# EasyEDA schematic SCH_everglow.json
TITLE: Sheet_1; REV: 1.0; Date: 2023-06-11; Sheet: 1/1; Drawn By: Sammy Oina; Company: Your Company
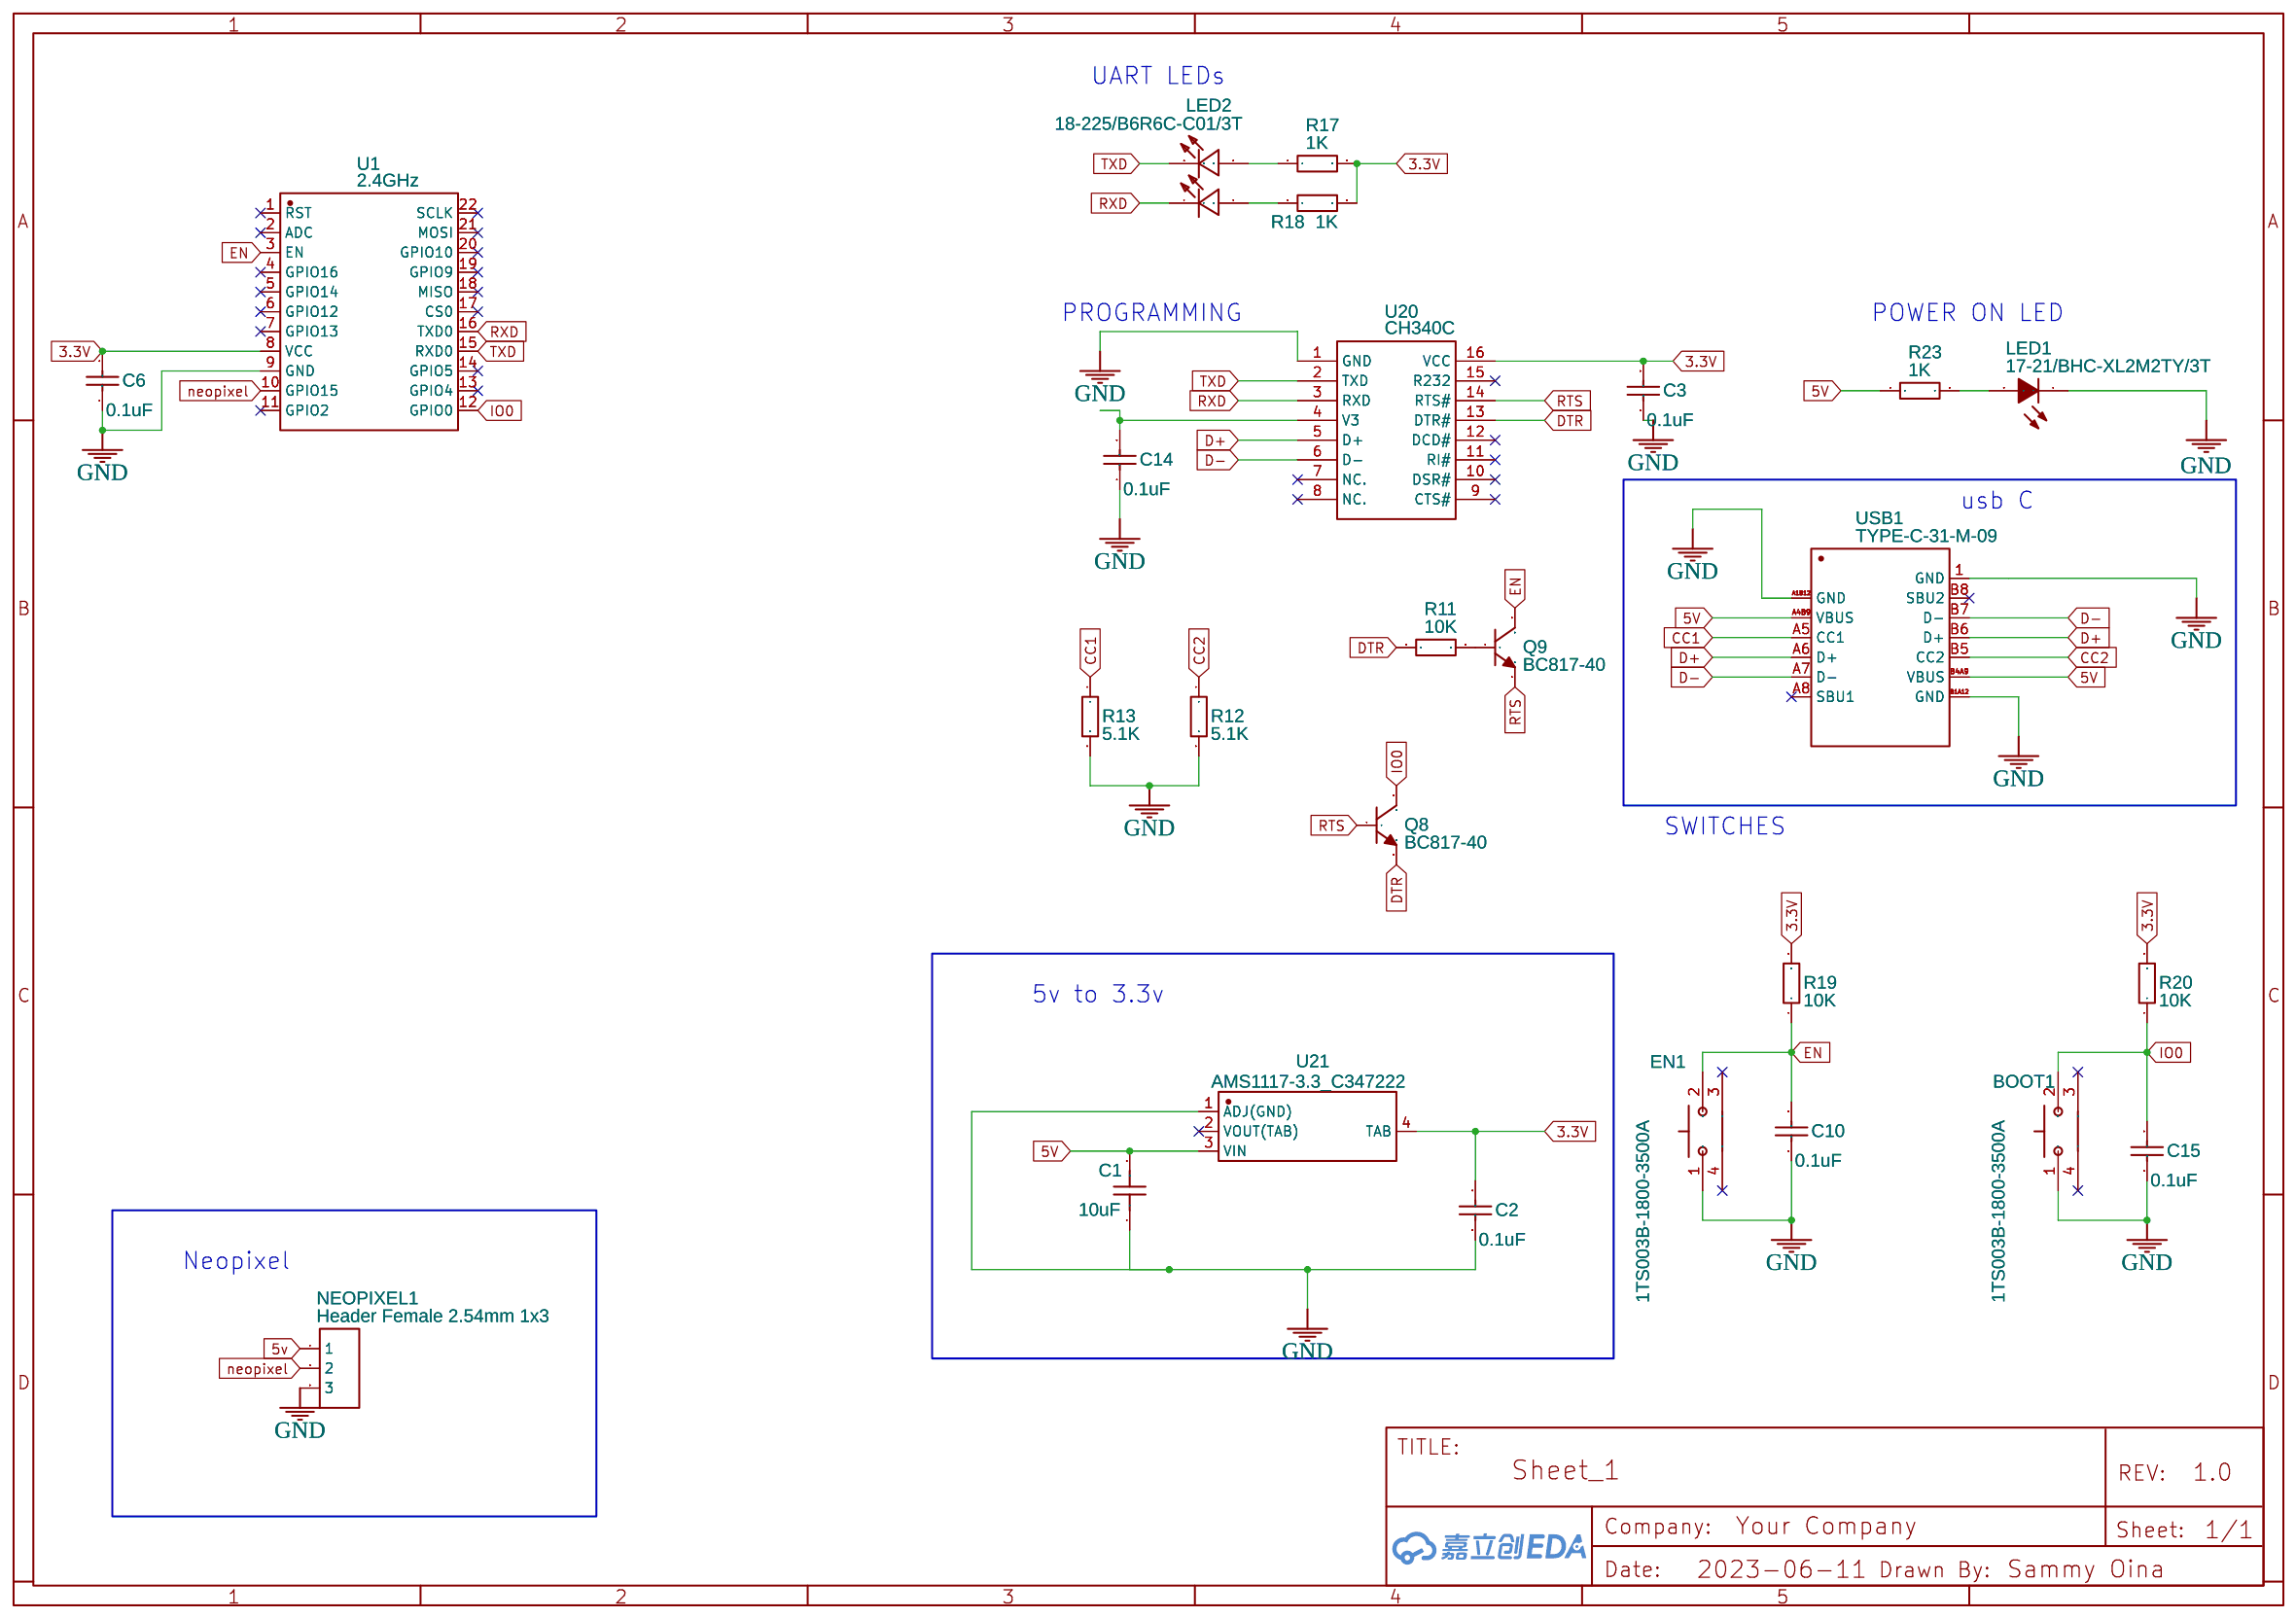
[diagram p0: schematic sheet]

## Parts
BOOT1  1TS003B-1800-3500A  [SW-SMD_1TS003B-XXXX-3500A-CT]
C1  10uF  [C0402]
C2  0.1uF  [C0603]
C3  0.1uF  [C0603]
C6  0.1uF  [C0603]
C10  0.1uF  [C0603]
C14  0.1uF  [C0603]
C15  0.1uF  [C0603]
EN1  1TS003B-1800-3500A  [SW-SMD_1TS003B-XXXX-3500A-CT]
LED1  17-21/BHC-XL2M2TY/3T  [LED0805-RD]
LED2  18-225/B6R6C-C01/3T  [LED-SMD_4P-L1.6-W0.8-BR-RD]
NEOPIXEL1  Header Female 2.54mm 1x3  [HEADER FEMALE 2.54MM 3X1]
Q8  BC817-40  [SOT-23-3_L2.9-W1.6-P1.90-LS2.8-BR]
Q9  BC817-40  [SOT-23-3_L2.9-W1.6-P1.90-LS2.8-BR]
R11  10K  [R0402]
R12  5.1K  [R0402]
R13  5.1K  [R0402]
R17  1K  [R0805]
R18  1K  [R0805]
R19  10K  [R0402]
R20  10K  [R0402]
R23  1K  [R0805]
U1  2.4GHz  [WIFIM-SMD_ESP-12F-ESP8266MOD]
U20  CH340C  [SOP-16_L10.0-W3.9-P1.27-LS6.0-BL]
U21  AMS1117-3.3_C347222  [SOT-223_L6.7-W3.5-P2.30-BR]
USB1  TYPE-C-31-M-09  [USB-C-SMD_TYPE-C-31-M-09]

## Library data of the parts
BOOT1 EN1 = 1TS003B-1800-3500A: Supplier: LCSC; Supplier Part: C255809; Manufacturer: HYP; Contributor: LCSC; JLCPCB Part Class: Extended Part; Package Display: No
C1 = CL05A106MQ8NUB8: Supplier: LCSC; Supplier Part: C307416; Manufacturer: Samsung Electro-Mechanics; Contributor: LCSC; JLCPCB Part Class: Extended Part
C2 C3 C6 C10 C14 C15 = 0603B104K250: Supplier: LCSC; Manufacturer: WTC; Supplier Part: C83054; JLCPCB Part Class: Extended Part
LED1 = 17-21/BHC-XL2M2TY/3T: Supplier: LCSC; Manufacturer: EVERLIGHT; Supplier Part: C72035; JLCPCB Part Class: Extended Part
LED2 = 18-225/B6R6C-C01/3T: Supplier: LCSC; Supplier Part: C282127; Manufacturer: Everlight Elec; Contributor: LCSC; JLCPCB Part Class: Extended Part
NEOPIXEL1 = Header Female 2.54mm 1x3: Supplier Part: C146243; Supplier: LCSC; Manufacturer: Boom Precision Elec; Manufacturer Part: Header-Female-2.54_1x3; link: https://datasheet.lcsc.com/szlcsc/Boom-Precision-Elec-2-54mm-1-8P-Straight-Female-header_C27438.pdf; Contributor: JOnesy99
Q8 Q9 = BC817-40: Supplier: LCSC; Manufacturer: Hottech; Contributor: LCSC; Supplier Part: C181151; JLCPCB Part Class: Extended Part
R11 R19 R20 = 0402WGJ0103TCE: Supplier: LCSC; Manufacturer: UniOhm; Supplier Part: C25531; JLCPCB Part Class: Extended Part
R12 R13 = 0402WGF5101TCE: Supplier: LCSC; Manufacturer: UniOhm; Supplier Part: C25905; JLCPCB Part Class: Basic Part
R17 R18 R23 = PTFR0805B1K00N9: Supplier: LCSC; Supplier Part: C328437; Manufacturer: ResistorToday; Contributor: LCSC; JLCPCB Part Class: Extended Part
U1 = ESP-12F(ESP8266MOD): Supplier: LCSC; Manufacturer: Ai-Thinker(安信可); Supplier Part: C82891; JLCPCB Part Class: Extended Part
U20 = CH340C: Supplier: LCSC; Manufacturer: WCH; Supplier Part: C84681; JLCPCB Part Class: Extended Part
U21 = AMS1117-3.3_C347222: Supplier: LCSC; Supplier Part: C347222; Manufacturer: Youtai Semiconductor Co., Ltd.; Manufacturer Part: AMS1117-3.3; Contributor: LCSC; JLCPCB Part Class: Extended Part
USB1 = TYPE-C-31-M-09: Supplier: LCSC; Supplier Part: C2689967; Manufacturer: 韩国韩荣; Contributor: LCSC; JLCPCB Part Class: Extended Part

## Nets
3.3V: C2.2 C3.2 C6.2 R17.2 R18.2 R19.2 R20.2 U1.8(VCC) U20.16(VCC) U21.4(TAB)
5V: C1.2 R23.1 U21.3(VIN) USB1.A4B9(VBUS) USB1.B4A9(VBUS)
5v: NEOPIXEL1.1
GND: BOOT1.1 C1.1 C2.1 C3.1 C6.1 C10.1 C14.1 C15.1 EN1.1 LED1.1(-) NEOPIXEL1.3 R12.2 R13.2 U1.9(GND) U20.1(GND) U21.1(ADJ(GND)) USB1.1(GND) USB1.A1B12(GND) USB1.B1A12(GND)
CC1: R13.1 USB1.A5(CC1)
CC2: R12.1 USB1.B5(CC2)
D+: U20.5(D+) USB1.A6(D+) USB1.B6(D+)
D-: U20.6(D-) USB1.A7(D-) USB1.B7(D-)
DTR: Q8.2 R11.1 U20.13(DTR#)
EN: C10.2 EN1.2 Q9.3 R19.1 U1.3(EN)
IO0: BOOT1.2 C15.2 Q8.3 R20.1 U1.12(GPIO0)
neopixel: NEOPIXEL1.2 U1.10(GPIO15)
RTS: Q8.1 Q9.2 U20.14(RTS#)
RXD: LED2.4 U1.16(TXD0) U20.3(RXD)
TXD: LED2.3 U1.15(RXD0) U20.2(TXD)
Net-(C14-2): C14.2 U20.4(V3)
Net-(LED1-2): LED1.2(+) R23.2
Net-(LED2-1): LED2.1 R18.1
Net-(LED2-2): LED2.2 R17.1
Net-(Q9-1): Q9.1 R11.2

Not connected (* = marked no-connect by the designer): BOOT1 3* 4*; EN1 3* 4*; U1 1(RST)* 2(ADC)* 4(GPIO16)* 5(GPIO14)* 6(GPIO12)* 7(GPIO13)* 11(GPIO2)* 13(GPIO4)* 14(GPIO5)* 17(CS0)* 18(MISO)* 19(GPIO9)* 20(GPIO10)* 21(MOSI)* 22(SCLK)*; U20 7(NC.)* 8(NC.)* 9(CTS#)* 10(DSR#)* 11(RI#)* 12(DCD#)* 15(R232)*; U21 2(VOUT(TAB))*; USB1 A8(SBU1)* B8(SBU2)*

## Notes on the sheet
- UART LEDs
- PROGRAMMING
- POWER ON LED
- usb C
- SWITCHES
- 5v to 3.3v
- Neopixel
